# EAGLE schematic Avionicapart1 (EAGLE 9.6.2)
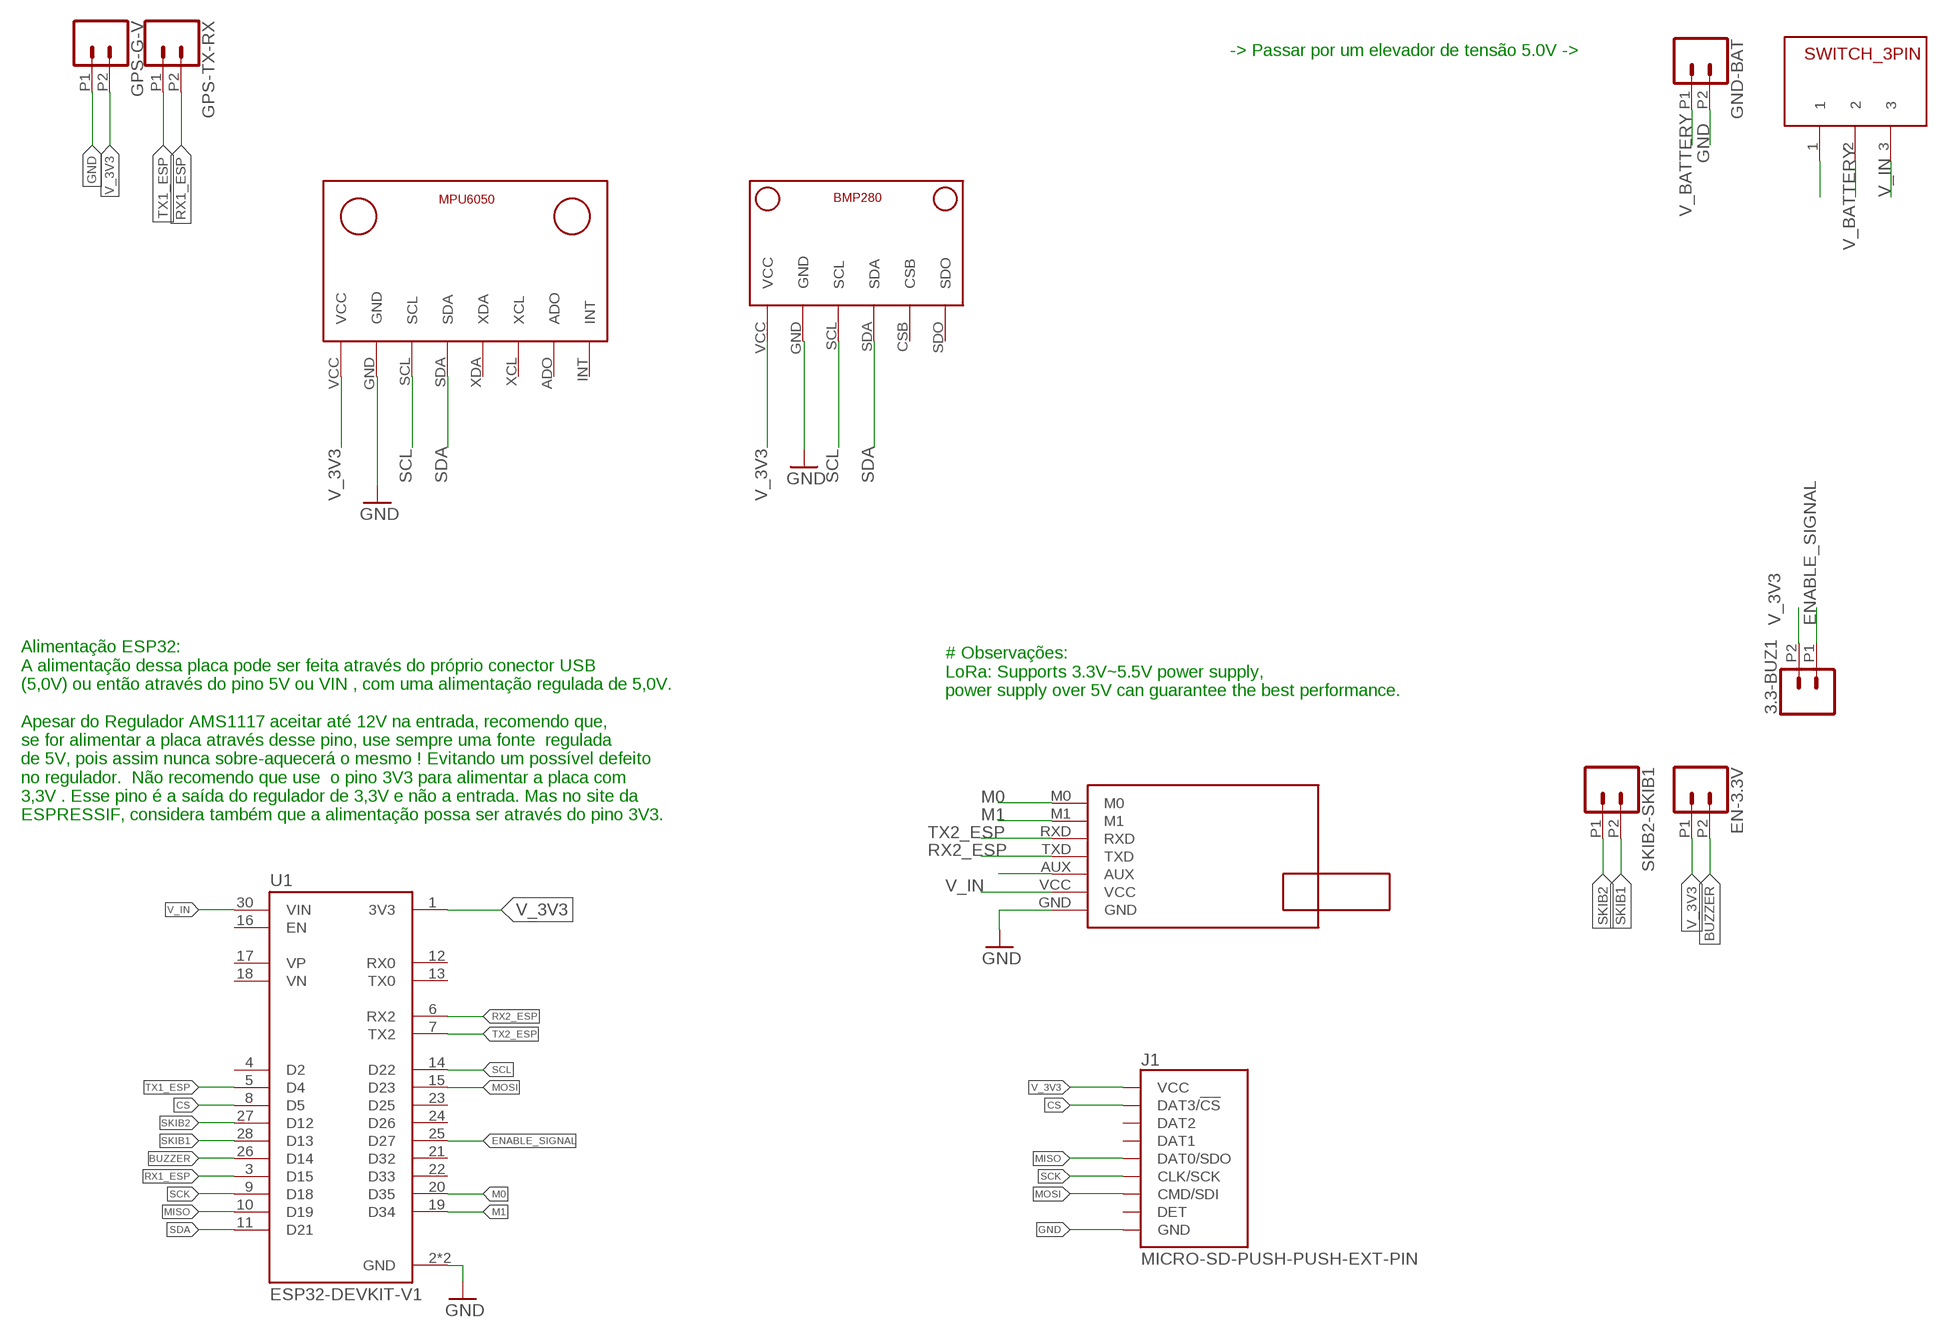
[diagram p0: schematic, sheet 1]

## Parts
3.3-BUZ1  CONN_022.54MM_SCREWTERM  [1X02_2.54_SCREWTERM]
EN-3.3V  CONN_022.54MM_SCREWTERM  [1X02_2.54_SCREWTERM]
GND-BAT  CONN_022.54MM_SCREWTERM  [1X02_2.54_SCREWTERM]
GPS-G-V  CONN_022.54MM_SCREWTERM  [1X02_2.54_SCREWTERM]
GPS-TX-RX  CONN_022.54MM_SCREWTERM  [1X02_2.54_SCREWTERM]
J1  MICRO-SD-PUSH-PUSH-EXT-PIN  [MICROSD-EXTERNALPIN]
SKIB2-SKIB1  CONN_022.54MM_SCREWTERM  [1X02_2.54_SCREWTERM]
U1  ESP32-DEVKIT-V1  [MODULE_ESP32_DEVKIT_V1]
U$2  E22-400T30D  [E22-400T30D_FOOTPRINT]
U$4  BMP280V1  [BMP280_FOOTPRINT]
U$6  MPU6050V1  [MPU6050_FOOTPRINT]
U$11  SWITCH_3PIN  [SWITCH_3PIN]

## Nets
BUZZER: EN-3.3V.P2 U1.26(D14)
CS: J1.2(DAT3/!CS!) U1.8(D5)
ENABLE_SIGNAL: 3.3-BUZ1.P1 U1.25(D27)
GND: GND-BAT.P2 GPS-G-V.P1 J1.6(GND) J1.10(GND) J1.11(GND) J1.12(GND) J1.13(GND) U1.2(GND) U1.29(GND) U$2.GND U$4.GND U$6.GND
M0: U1.20(D35) U$2.M0
M1: U1.19(D34) U$2.M1
MISO: J1.7(DAT0/SDO) U1.10(D19)
MOSI: J1.3(CMD/SDI) U1.15(D23)
N$3: U$2.AUX
N$4: U$11.1
RX1_ESP: GPS-TX-RX.P2 U1.3(D15)
RX2_ESP: U1.6(RX2) U$2.TXD
SCK: J1.5(CLK/SCK) U1.9(D18)
SCL: U1.14(D22) U$4.SCL U$6.SCL
SDA: U1.11(D21) U$4.SDA U$6.SDA
SKIB1: SKIB2-SKIB1.P2 U1.28(D13)
SKIB2: SKIB2-SKIB1.P1 U1.27(D12)
TX1_ESP: GPS-TX-RX.P1 U1.5(D4)
TX2_ESP: U1.7(TX2) U$2.RXD
V_3V3: 3.3-BUZ1.P2 EN-3.3V.P1 GPS-G-V.P2 J1.4(VCC) U1.1(3V3) U$4.VCC U$6.VCC
V_BATTERY: GND-BAT.P1 U$11.2
V_IN: U1.30(VIN) U$2.VCC U$11.3
Unconnected: J1.1(DAT2) J1.8(DAT1) J1.9(DET) U1.4(D2) U1.12(RX0) U1.13(TX0) U1.16(EN) U1.17(VP) U1.18(VN) U1.21(D32) U1.22(D33) U1.23(D25) U1.24(D26) U$4.CSB U$4.SDO U$6.ADO U$6.INT U$6.XCL U$6.XDA

## Notes on the sheet
- -> Passar por um elevador de tensão 5.0V ->
- # Observações:
  LoRa: Supports 3.3V~5.5V power supply, 
  power supply over 5V can guarantee the best performance.
- Alimentação ESP32:
  A alimentação dessa placa pode ser feita através do próprio conector USB
  (5,0V) ou então através do pino 5V ou VIN , com uma alimentação regulada de 5,0V.
  
  Apesar do Regulador AMS1117 aceitar até 12V na entrada, recomendo que,
  se for alimentar a placa através desse pino, use sempre uma fonte  regulada
  de 5V, pois assim nunca sobre-aquecerá o mesmo ! Evitando um possível defeito
  no regulador.  Não recomendo que use  o pino 3V3 para alimentar a placa com
  3,3V . Esse pino é a saída do regulador de 3,3V e não a entrada. Mas no site da
  ESPRESSIF, considera também que a alimentação possa ser através do pino 3V3.

## Library data of the parts
3.3-BUZ1 EN-3.3V GND-BAT GPS-G-V GPS-TX-RX SKIB2-SKIB1 = SparkFun-Connectors:CONN_02: Multi connection point. Often used as Generic Header-pin footprint for 0.1 inch spaced/style header connections On any of the 0.1 inch spaced packages, you can populate with these: Break Away Headers - Straight <https://www.sparkfun.com/products/116> (PRT-00116) Break Away Male Headers - Right Angle <https://www.sparkfun.com/products/553> (PRT-00553) Female Headers <https://www.sparkfun.com/products/115> (PRT-00115) Break Away Headers - Machine Pin <https://www.sparkfun.com/products/117> (PRT-00117) Break Away Female Headers - Swiss Machine Pin <https://www.sparkfun.com/products/743> (PRT-00743) For SCREWTERMINALS and SPRING TERMINALS visit here: Screw Terimnals on SparkFun.com <https://www.sparkfun.com/search/results?term=Screw+Terminals> (5mm/3.5mm/2.54mm spacing) This device is also useful as a general connection point to wire up your design to another part of your project. Our various solder wires solder well into these plated through hole pads. Hook-Up Wire - Assortment (Stranded, 22 AWG) <https://www.sparkfun.com/products/11375> (PRT-11375) Hook-Up Wire - Assortment (Solid Core, 22 AWG) <https://www.sparkfun.com/products/11367> (PRT-11367) View the entire wire category on our website here <https://www.sparkfun.com/categories/141> Special notes: Molex polarized connector foot print use with: PRT-08233 with associated crimp pins and housings. 2.54_SCREWTERM for use with PRT-10571. 3.5mm Screw Terminal footprints for PRT-08084 5mm Screw Terminal footprints for use with PRT-08432
J1 = SparkFun-Connectors:MICRO-SD: microSD Socket for Transflash Various sockets for µSD. tDoc lines correctly indicate media card edge positions when inserting (unlocked, locked, depressed). NOTE: CD1 and CD2 are connected internally, and the default detect state of the socket is detect pin to ground. SparkFun Products: WAV Trigger <https://www.sparkfun.com/products/13660> CAN-Bus Shield <https://www.sparkfun.com/products/13262> SparkFun Level Shifing microSD Breakout <https://www.sparkfun.com/products/13743>; PROD_ID: CONN-16110
U1 = ESP32-DEVKIT-V1:ESP32-DEVKIT-V1: Dual core, Wi-Fi: 2.4 GHz up to 150 Mbits/s,BLE (Bluetooth Low Energy) and legacy Bluetooth, 32 bits, Up to 240 MHz Check availability <https://pricing.snapeda.com/parts/ESP32-DEVKIT-V1/Do%20it/view-part?ref=eda>; AVAILABILITY: Not in stock; DESCRIPTION: Dual core, Wi-Fi: 2.4 GHz up to 150 Mbits/s,BLE (Bluetooth Low Energy) and legacy Bluetooth, 32 bits, Up to 240 MHz; MF: Do it; MP: ESP32-DEVKIT-V1; PACKAGE: None; PRICE: None
U$2 = CRD:E22-400T30D
U$4 = CRD:BMP280: Sensor barométrico
U$6 = CRD:MPU6050: Acelerômetro e Giroscópio
U$11 = CRD:SWITCH_3PIN